# EAGLE design PCB_baseStation (EAGLE 6.5.0)
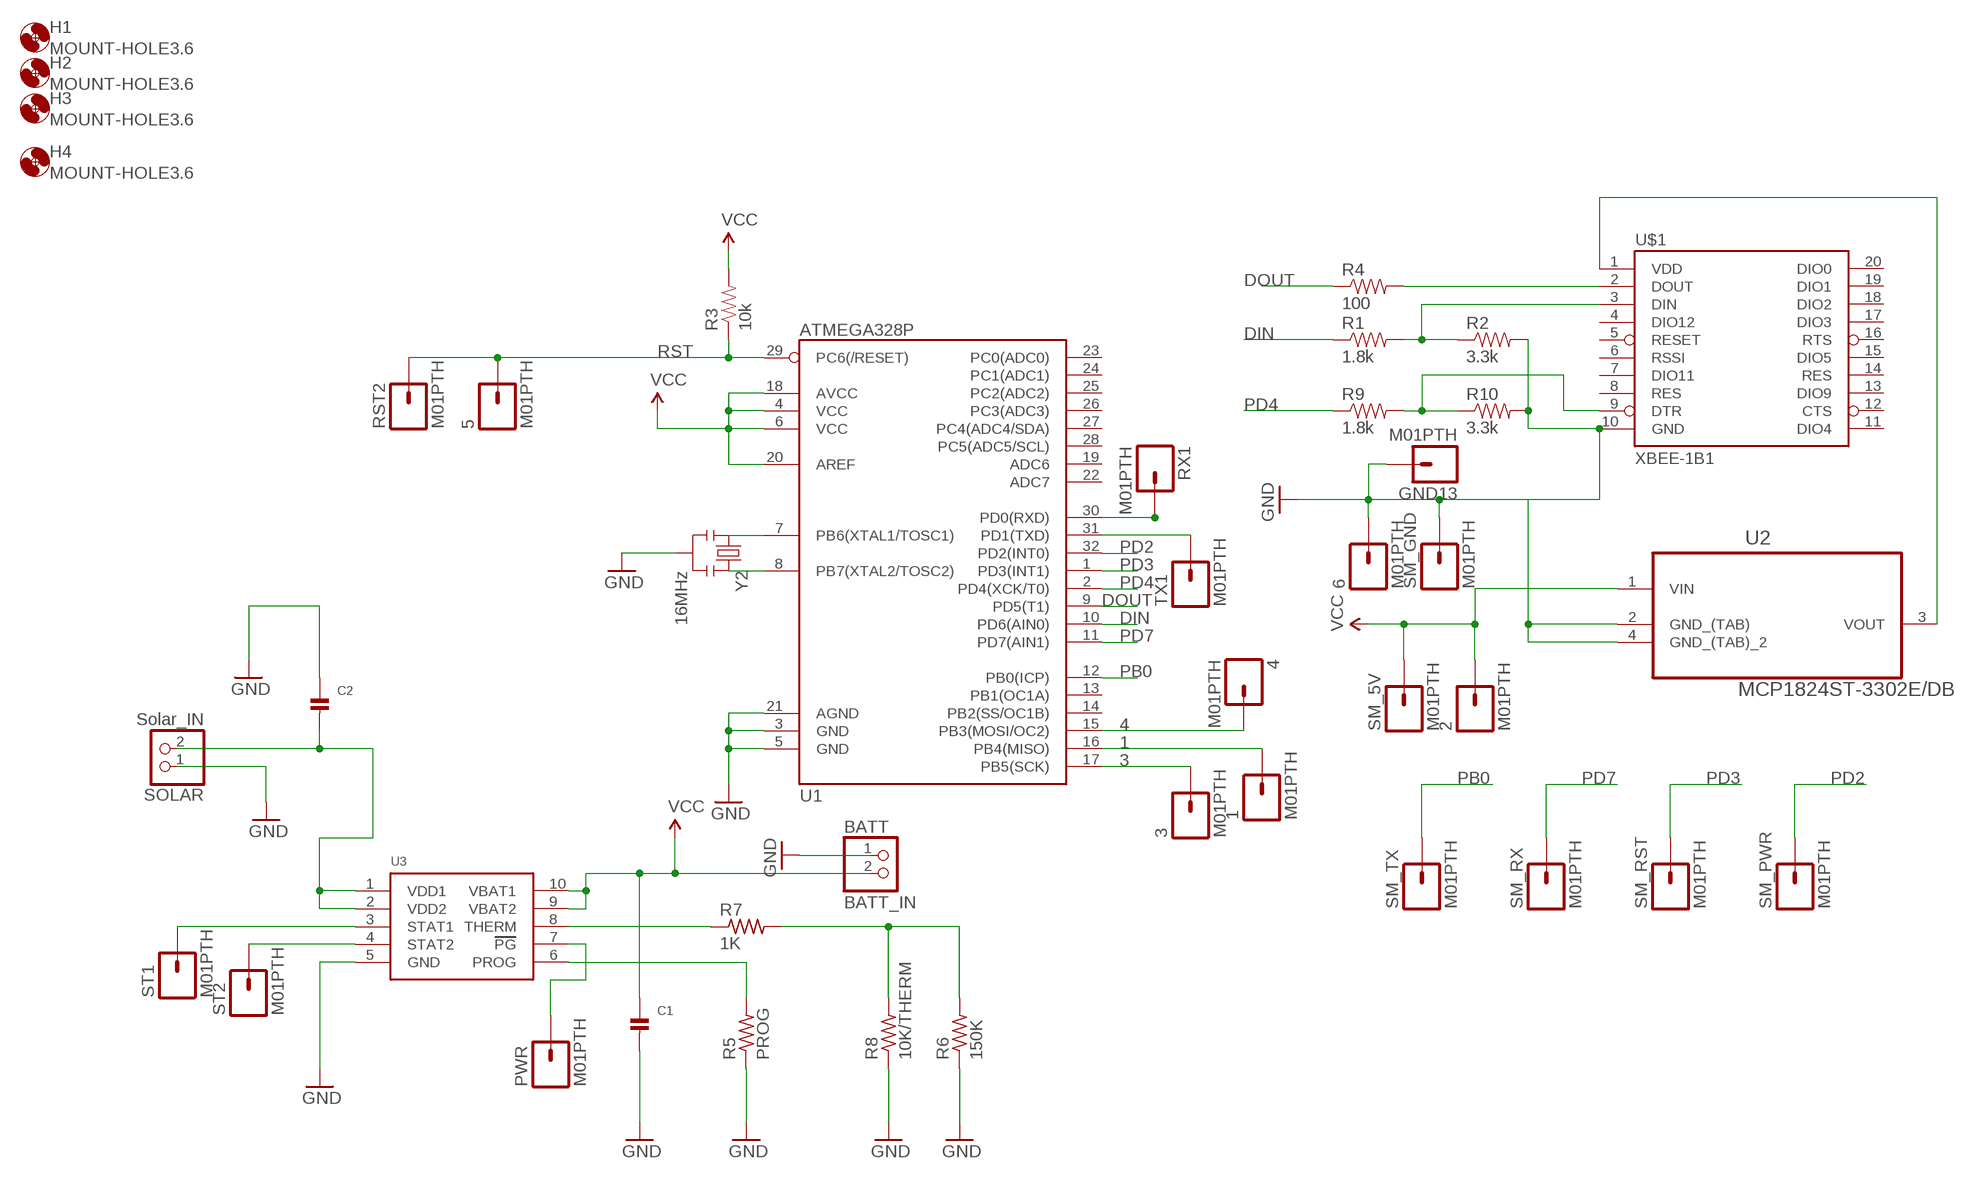
[diagram p0: schematic, sheet 1]

## Parts
1  M01PTH  [1X01]
2  M01PTH  [1X01]
3  M01PTH  [1X01]
4  M01PTH  [1X01]
5  M01PTH  [1X01]
6  M01PTH  [1X01]
BATT  BATT_IN  JST_2PIN  [JSTPH2]
C1  CAP_CERAMIC0805  [0805]
C2  CAP_CERAMIC0805  [0805]
GND13  M01PTH  [1X01]
H1  MOUNT-HOLE3.6  [3,6]
H2  MOUNT-HOLE3.6  [3,6]
H3  MOUNT-HOLE3.6  [3,6]
H4  MOUNT-HOLE3.6  [3,6]
PWR  M01PTH  [1X01]
R1  1.8k  1.8KOHM1/10W1%(0603)  [0603-RES]
R2  3.3k  3.3KOHM1/10W1%(0603)  [0603-RES]
R3  10k  RESISTOR1206  [1206]
R4  100  100OHM1/10W1%(0603)  [0603-RES]
R5  PROG  RESISTOR_DUAL  [0805-THM]
R6  150K  R-US_M0805  [M0805]
R7  1K  R-US_M0805  [M0805]
R8  10K/THERM  R-US_FLIPFLOP  [0805-THM]
R9  1.8k  1.8KOHM1/10W1%(0603)  [0603-RES]
R10  3.3k  3.3KOHM1/10W1%(0603)  [0603-RES]
RST2  M01PTH  [1X01]
RX1  M01PTH  [1X01]
SM_5V  M01PTH  [1X01]
SM_GND  M01PTH  [1X01]
SM_PWR  M01PTH  [1X01]
SM_RST  M01PTH  [1X01]
SM_RX  M01PTH  [1X01]
SM_TX  M01PTH  [1X01]
SOLAR  Solar_IN  JST_2PIN  [JSTPH2]
ST1  M01PTH  [1X01]
ST2  M01PTH  [1X01]
TX1  M01PTH  [1X01]
U1  ATMEGA328P  ATMEGA328_SMT  [TQFP32-08]
U2  MCP1824ST-3302E/DB  [SOT230P700X180-4N]
U3  MCP73833  [MSOP10]
U$1  XBEE-1B1  [XBEE-1]
Y2  16MHz  RESONATOR16MHZ  [RESONATOR-SMD]

## Nets
1: 1.1 U1.16(PB4(MISO))
3: 3.1 U1.17(PB5(SCK))
4: 4.1 U1.15(PB3(MOSI/OC2))
DIN: R1.1 U1.10(PD6(AIN0))
DOUT: R4.1 U1.9(PD5(T1))
GND: 6.1 BATT.1 C1.2 C2.1 GND13.1 R2.2 R5.1 R6.1 R8.1 R10.2 SM_GND.1 SOLAR.1 U1.3(GND) U1.5(GND) U1.21(AGND) U2.2(GND_(TAB)) U2.4(GND_(TAB)_2) U3.5(GND) U$1.10(GND) Y2.2
N$1: ST1.1 U3.3(STAT1)
N$2: ST2.1 U3.4(STAT2)
N$3: R1.2 R2.1 U$1.3(DIN)
N$4: R4.2 U$1.2(DOUT)
N$6: R9.2 R10.1 U$1.9(DTR)
N$7: U1.7(PB6(XTAL1/TOSC1)) Y2.1
N$8: U1.8(PB7(XTAL2/TOSC2)) Y2.3
N$9: C2.2 SOLAR.2 U3.1(VDD1) U3.2(VDD2)
N$10: R5.2 U3.6(PROG)
N$11: PWR.1 U3.7(PG)
N$13: R6.2 R7.2 R8.2
N$14: U2.3(VOUT) U$1.1(VDD)
N$15: R7.1 U3.8(THERM)
N$19: TX1.1 U1.31(PD1(TXD))
N$20: RX1.1 U1.30(PD0(RXD))
PB0: SM_TX.1 U1.12(PB0(ICP))
PD2: SM_PWR.1 U1.32(PD2(INT0))
PD3: SM_RST.1 U1.1(PD3(INT1))
PD4: R9.1 U1.2(PD4(XCK/T0))
PD7: SM_RX.1 U1.11(PD7(AIN1))
RST: 5.1 R3.1 RST2.1 U1.29(PC6(/RESET))
VCC: 2.1 BATT.2 C1.1 R3.2 SM_5V.1 U1.4(VCC) U1.6(VCC) U1.18(AVCC) U1.20(AREF) U2.1(VIN) U3.9(VBAT2) U3.10(VBAT1)
Unconnected: U1.13(PB1(OC1A)) U1.14(PB2(SS/OC1B)) U1.19(ADC6) U1.22(ADC7) U1.23(PC0(ADC0)) U1.24(PC1(ADC1)) U1.25(PC2(ADC2)) U1.26(PC3(ADC3)) U1.27(PC4(ADC4/SDA)) U1.28(PC5(ADC5/SCL)) U$1.4(DIO12) U$1.5(RESET) U$1.6(RSSI) U$1.7(DIO11) U$1.8(RES) U$1.11(DIO4) U$1.12(CTS) U$1.13(DIO9) U$1.14(RES) U$1.15(DIO5) U$1.16(RTS) U$1.17(DIO3) U$1.18(DIO2) U$1.19(DIO1) U$1.20(DIO0)

## Library data of the parts
1-6 GND13 PWR RST2 RX1 SM_5V SM_GND SM_PWR SM_RST SM_RX SM_TX ST1 ST2 TX1 = SparkFun-Connectors:M01: Header 1 Standard 1-pin 0.1" header. Use with straight break away headers (SKU : PRT-00116), right angle break away headers (PRT-00553), swiss pins (PRT-00743), machine pins (PRT-00117), and female headers (PRT-00115).
BATT SOLAR = microbuilder:JST_2PIN: JST 2-Pin Right-Angle Connector PH-Series - 4UConnector: 17311 SH-Series - 4UConnector: 07278
C1 C2 = microbuilder:CAP_CERAMIC: Ceramic Capacitors 0402 - 0402 Surface Mount Capacitors 16pF 50V 5% [Digikey: 445-4899-2-ND] 18pF 50V 5% [Digikey: 490-1281-2-ND] 22pF 50V 5% [Digikey: 490-1283-2-ND] 68pF 50V 5% [Digikey: 490-1289-2-ND] 0.1uF 10V 10% [Digikey: 490-1318-2-ND] 1.0uF 6.3V 10% [Digikey: 490-1320-2-ND] 0603 - 0603 Surface Mount Capacitors 16 pF 50V 5% [Digikey: 445-5051-2-ND] 22 pF 50V [Digikey: PCC220ACVTR-ND] 33 pF 50V 5% [Digikey: 490-1415-1-ND] 56pF 50V 5% [Digikey: 490-1421-1-ND] 220pF 50V 5% [Digikey: 445-1285-1-ND] 680 pF 50V 2200 pF 50V 5% C0G [Digikey: 445-1297-1-ND] 5600 pF 100V 5% X7R [Digikey: 478-3711-1-ND] 0.1 µF 25V 10% [Digikey: PCC2277TR-ND] 0.22 µF 16V 10% X7R [Digikey: 445-1318-1-ND] 1.0 µF 25V 10% [Digikey: 445-5146-2-ND] 0603 - RF Specific 3pF 250V +/-0.1pF RF [Digikey: 712-1347-1-ND] 18 pF 250V 5% [Digikey: 478-3505-1-ND or 712-1322-1-ND] 56 pF 250V 5% C0G RF [Digikey: 490-4867-1-ND] 68 pF 250V RF [Digikey: 490-4868-1-ND] 0805 - 0805 Surface Mount Capacitors 220 pF 250V 2% RF Ceramic Capacitor [Digikey: 712-1398-1-ND] 1000 pF 50V 2% NP0 Ceramic Capacitor [Digikey: 478-3760-1-ND] 0.1 µF 25V 10% Ceramic Capacitor [Digikey: PCC1828TR-ND] 1.0 µF 16V 10% Ceramic Capacitor[Digikey: 490-1691-2-ND] 10.0 µF 10V 10% Ceramic Capacitor[Digikey: 709-1228-1-ND] 10.0 uF 16V 10% Ceramic Capacitor [Digikey: 478-5165-2-ND] 47 uF 6.3V 20% Ceramic Capacitor [Digikey: 587-1779-1-ND or 399-5506-1-ND] 1206 - 1206 Surface Mount Capacitors 47uF 10V 20% Ceramic Capacitor [Digikey: 490-5528-1-ND or 399-5508-1-ND or 445-6010-1-ND] 100uF 6.3V -20%, +80% Y5V Ceramic Capacitor (Digikey: 490-4512-1-ND, Mouser: 81-GRM31CF50J107ZE1L)
H1-H4 = holes:MOUNT-HOLE: MOUNTING HOLE with drill center marker
R1 R9 = SparkFun-Resistors:1.8KOHM1/10W1%(0603): RES-09119; PROD_ID: RES-09119
R2 R10 = SparkFun-Resistors:3.3KOHM1/10W1%(0603): RES-07851; PROD_ID: RES-07851
R3 = SparkFun-Resistors:RESISTOR: Resistor Basic schematic elements and footprints for 0603, 1206, and PTH resistors.
R4 = SparkFun-Resistors:100OHM1/10W1%(0603): RES-07863; PROD_ID: RES-07863
R5 = microbuilder:RESISTOR_DUAL: Flip Flop resistor An 0805 resistor inside a standard 1/4W 5% resistor. Makes for easy mods Footprint taken from the Adafruit Industries Eagle Library.
R6-R8 = adafruit:R-US_: RESISTOR, American symbol
U1 = SparkFun-DigitalIC:ATMEGA328_SMT: 32-Pin Atmega328 part Commonly used on Arduino compatible boards Available in QFP and QFN packages TQFP is IC-09069 QFN is non-stock; PROD_ID: IC-09069
U2 = Microchip_By_element14_Batch_1:MCP1824ST-3302E/DB: IC, LDO VOLT REG, 3.3V, 0.3A,; MPN: MCP1824ST-3302E/DB; OC_FARNELL: 1578379; OC_NEWARK: 05N1293; PACKAGE: SOT-223-3; SUPPLIER: Microchip
U3 = microbuilder:MCP73833: Lithium-Polymer/Lithium-Ion Battery Charger [Part No.] Microchip MCP73833 MSOP10 (tube only): Digikey: MCP73833T-AMI/UN or MCP73833-FCI/UN-ND Mouser: 579-MCP73833-AMI/UN DFN10 (tape): Digikey: Note Chips ending in 'AMI' have no timer, and chips ending in 'FCI' have a 6-hour timer that will end the charge sequence after 6 horus regqrdless of current charge level.
U$1 = SparkFun-RF:XBEE-1: Xbee module footprints SMT header is CONN-09042.
Y2 = SparkFun-FreqCtrl:RESONATOR: Resonator Small SMD resonator. Used, eg, on the Arduino Pro/ Pro Mini boards. 8MHz- XTAL-08895 16MHz- XTAL-08900; PROD_ID: XTAL-08900

## Board
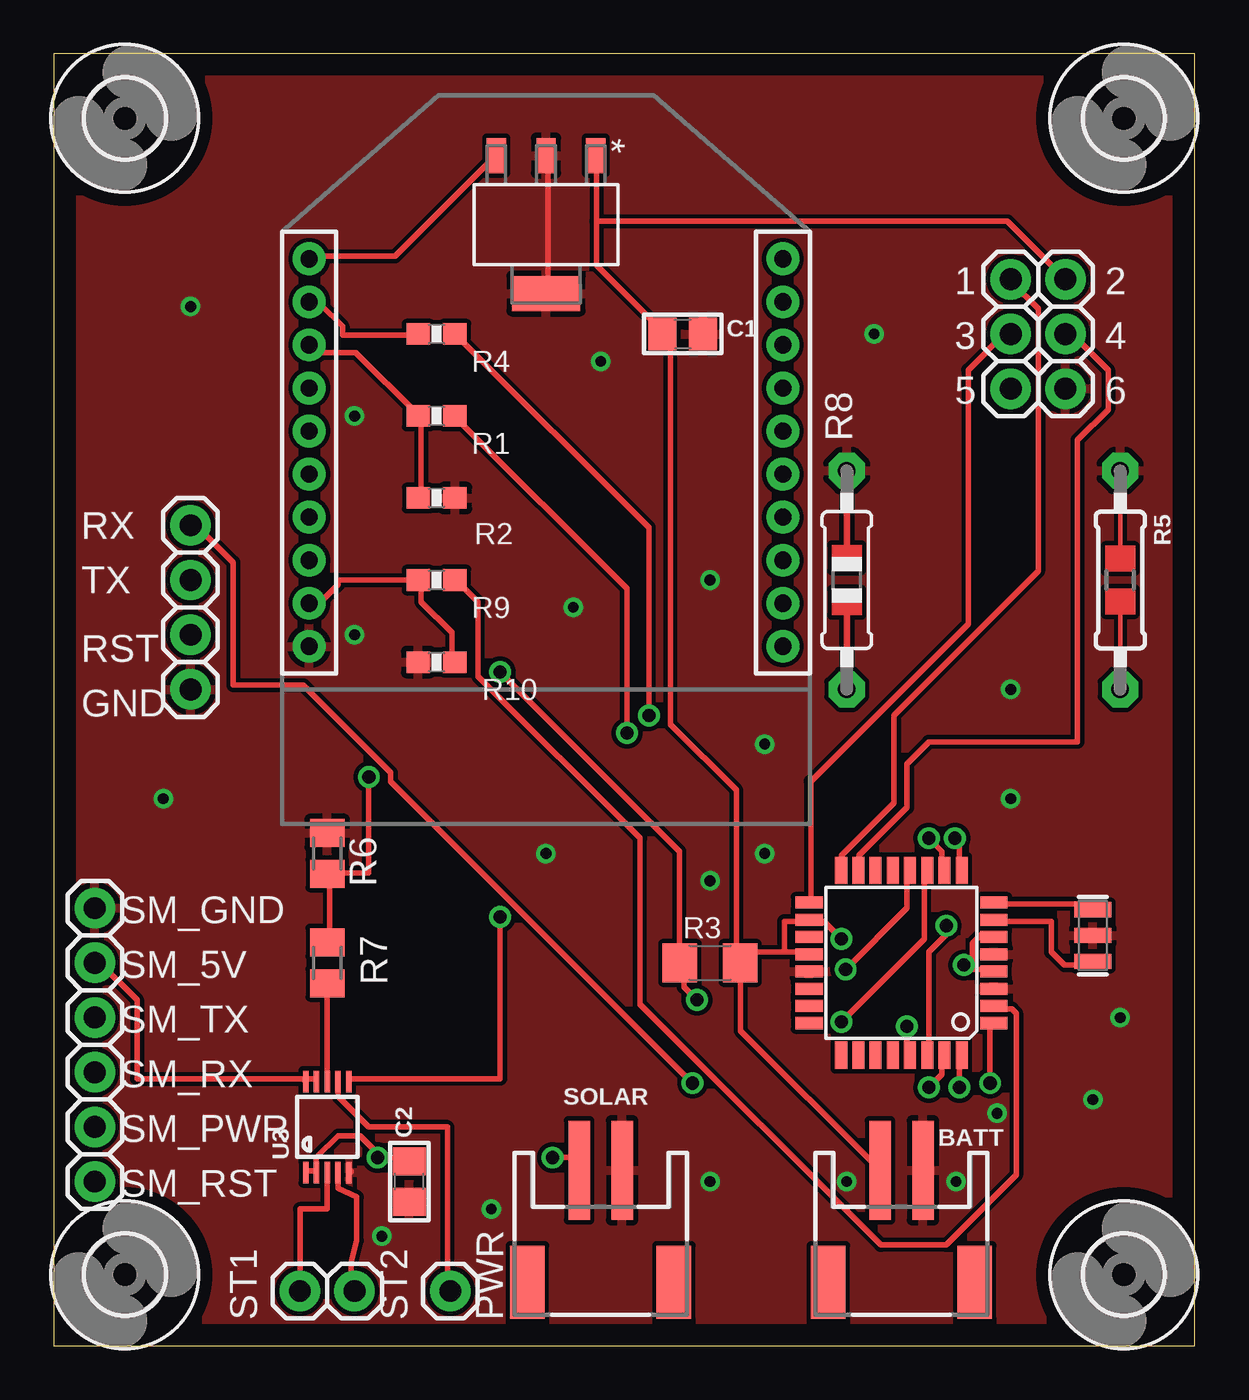
[diagram p1: board, top side]
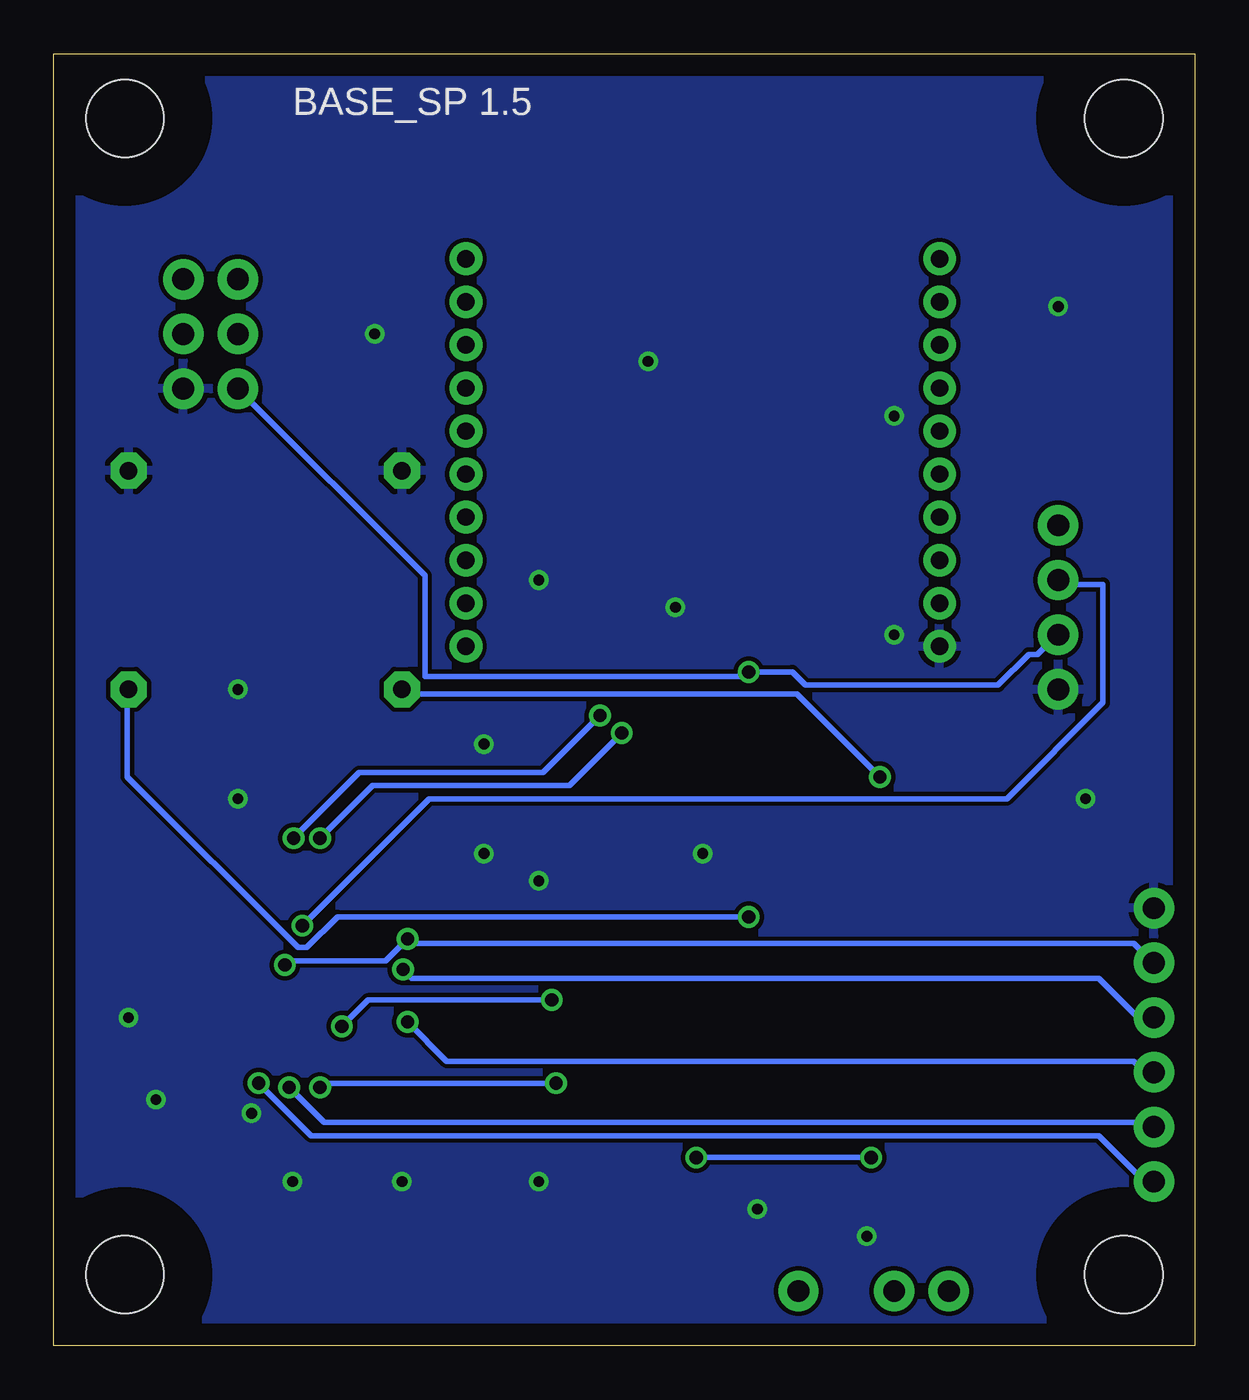
[diagram p2: board, bottom side, seen from below]

Size 53 x 60 mm. Coordinates in mm from the lower left corner, seen from the top.
Outline: 0,0 53,0 53,60 0,60 0,0
Copper layers (1*16): Top 0.035mm / dielectric 1.5mm / Bottom 0.035mm
Design rules "default": minimum track width 10mil, minimum drill 24mil, track to track 8mil, track to pad 8mil, pad to pad 8mil, via to via 8mil, smd to smd 8mil, copper to edge 40mil, drill to drill 8mil, minimum pad ring 10mil, minimum via ring 8mil, stop-mask expansion 4mil, vias tented up to drill 0mil, thermal gap 10mil

### Footprints (pad centres in the part's own frame; a part is rotated, then mirrored left to right if it is on the bottom)
1X01 = drill 1.016 pad 1.88: 1 0,0
JSTPH2 = smd 1 x 4.6: 1 -1,-3.7; 2 1,-3.7 | smd 1.6 x 3.4: NC1 -3.4,1.5; NC2 3.4,1.5
0805 = smd 1.3 x 1.5: 1 -0.95,0; 2 0.95,0
3,6 = hole 3.6: 0,0
0603-RES = smd 1.1 x 1: 1 -0.85,0; 2 0.85,0
1206 = smd 1.6 x 1.8: 1 -1.4,0; 2 1.4,0
0805-THM = drill 0.813 pad 1.676 octagon: 1 -5.08,0; 2 5.08,0
M0805 = smd 1.3 x 1.6: 1 -0.95,0; 2 0.95,0
TQFP32-08 = smd 1.27 x 0.559: 1 -4.293,2.8; 2 -4.293,2; 3 -4.293,1.2; 4 -4.293,0.4; 5 -4.293,-0.4; 6 -4.293,-1.2; 7 -4.293,-2; 8 -4.293,-2.8; 17 4.293,-2.8; 18 4.293,-2; 19 4.293,-1.2; 20 4.293,-0.4; 21 4.293,0.4; 22 4.293,1.2; 23 4.293,2; 24 4.293,2.8 | smd 0.559 x 1.27: 9 -2.8,-4.293; 10 -2,-4.293; 11 -1.2,-4.293; 12 -0.4,-4.293; 13 0.4,-4.293; 14 1.2,-4.293; 15 2,-4.293; 16 2.8,-4.293; 25 2.8,4.293; 26 2,4.293; 27 1.2,4.293; 28 0.4,4.293; 29 -0.4,4.293; 30 -1.2,4.293; 31 -2,4.293; 32 -2.8,4.293
SOT230P700X180-4N = smd 1.626 x 0.889: 1 -3.2,2.311; 2 -3.2,0; 3 -3.2,-2.311 | smd 1.626 x 3.175: 4 3.2,0
MSOP10 = smd 0.25 x 1: 1 -1,-2.113; 2 -0.5,-2.113; 3 0,-2.113; 4 0.5,-2.113; 5 1,-2.113; 6 1,2.113; 7 0.5,2.113; 8 0,2.113; 9 -0.5,2.113; 10 -1,2.113
XBEE-1 = drill 0.8 pad 1.524: 1 -11,20; 2 -11,18; 3 -11,16; 4 -11,14; 5 -11,12; 6 -11,10; 7 -11,8; 8 -11,6; 9 -11,4; 10 -11,2; 11 11,2; 12 11,4; 13 11,6; 14 11,8; 15 11,10; 16 11,12; 17 11,14; 18 11,16; 19 11,18; 20 11,20
RESONATOR-SMD = smd 0.7 x 1.7: 1 -1.2,0; 2 0,0; 3 1.2,0

### Placement (x,y rotation side)
1  44.45,49.53 0 top
2  46.99,49.53 0 top
3  44.45,46.99 0 top
4  46.99,46.99 0 top
5  44.45,44.45 0 top
6  46.99,44.45 0 top
BATT  39.37,4.45 180 top
C1  29.21,46.99 0 top
C2  16.51,7.62 90 top
GND13  6.35,30.48 0 top
H1  3.3,57 0 top
H2  3.3,3.3 0 top
H3  49.7,57 0 top
H4  49.7,3.3 0 top
PWR  18.41,2.54 0 top
R1  17.78,43.18 180 top
R2  17.78,39.37 0 top
R3  30.48,17.78 0 top
R4  17.78,46.99 180 top
R5  49.53,35.56 270 top
R6  12.7,22.86 270 top
R7  12.7,17.78 90 top
R8  36.83,35.56 270 top
R9  17.78,35.56 180 top
R10  17.78,31.75 180 top
RST2  6.35,33.02 0 top
RX1  6.35,35.56 0 top
SM_5V  1.91,17.78 0 top
SM_GND  1.91,20.32 0 top
SM_PWR  1.91,10.16 0 top
SM_RST  1.91,7.62 0 top
SM_RX  1.91,12.7 0 top
SM_TX  1.91,15.24 0 top
SOLAR  25.4,4.45 180 top
ST1  11.43,2.54 0 top
ST2  13.97,2.54 0 top
TX1  6.35,38.1 0 top
U1  39.37,17.78 180 top
U2  22.86,52.07 270 top
U3  12.7,10.16 0 top
U$1  22.86,30.48 0 top
Y2  48.26,19.05 90 top

### Tracks (layer width: path | path; a pad name or v marks a point on that pad's centre or on a via)
1
  Top 0.254: U1.16 36.58,22.15 36.58,22.76 39.01,25.2 39.01,29.26 45.72,35.97 45.72,48.16 44.5,49.38 1.1
3
  Top 0.254: U1.17 35.15,20.73 35.15,26.21 42.47,33.53 42.47,45.31 44.3,47.14 3.1
4
  Top 0.254: U1.15 37.39,22.15 37.39,22.76 39.62,24.99 39.62,27.03 40.64,28.04 47.55,28.04 47.55,42.06 48.97,43.48 48.97,45.31 47.14,47.14 4.1
DIN  (via drill 0.61)
  Top 0.254: v26.62,28.45 26.62,35.15 18.69,43.08 R1.1 | v40.64,23.57 41.25,22.96 41.25,22.15 U1.10
  Bottom 0.254: v26.62,28.45 29.06,26.01 38.2,26.01 v40.64,23.57
DOUT  (via drill 0.61)
  Top 0.254: v27.64,29.26 27.64,38 18.69,46.94 R4.1 | v41.86,23.57 42.06,23.37 42.06,22.15 U1.9
  Bottom 0.254: v27.64,29.26 30.28,26.62 38.81,26.62 v41.86,23.57
GND  (via drill 0.5)
  Top 0.254: U3.5 13.82,8.13 13.82,8.05 | 16.46,6.5 C2.1 | U2.2 22.96,55.27 22.96,48.97 U2.4
  other vias: 20.32,6.35 15.24,5.08 30.48,7.62 36.83,7.62 41.91,7.62 43.81,10.79 48.26,11.43 49.53,15.24 44.45,25.4 33.02,22.86 30.48,21.59 22.86,22.86 33.02,27.94 5.08,25.4 24.13,34.29 13.97,33.02 30.48,35.56 13.97,43.18 25.4,45.72 6.35,48.26 38.1,46.99 44.45,30.48
  pour Top: -3.81,62.23 -3.81,-2.54 55.88,-2.54 55.88,62.23
  pour Bottom: -3.81,58.42 -3.81,0 -3.81,-2.54 55.88,-2.54 55.88,-1.27 55.88,62.23 -3.81,62.23
N$1
  Top 0.254: U3.3 12.7,6.35 11.43,6.35 ST1.1
N$2
  Top 0.254: U3.4 13.21,7.92 13.21,7.32 14.07,6.91 14.07,4.88 13.82,3.86 13.82,2.64 ST2.1
N$3
  Top 0.254: R2.1 17.07,39.42 17.07,43.08 R1.2 16.87,43.28 14.02,46.13 11.99,46.13 11.99,46.33 U$1.3
N$4
  Top 0.254: R4.2 16.87,46.94 13.41,46.94 13.41,47.35 12.39,48.36 11.99,48.36 U$1.2
N$5
  Top 0.254: 6.3,35.56 6.35,35.56
N$6
  Top 0.254: R10.1 18.49,31.9 18.49,33.12 17.07,34.54 17.07,35.56 R9.2 13.21,35.56 13.21,35.36 12.39,34.54 11.99,34.54 U$1.9
N$7
  Top 0.254: U1.7 43.69,19.71 46.33,19.71 46.33,18.29 46.94,17.68 48.16,17.68 Y2.1
N$8
  Top 0.254: U1.8 43.69,20.52 48.16,20.52 48.16,20.32 Y2.3
N$9  (via drill 0.61)
  Top 0.254: 12.19,8.13 11.79,8.13 U3.1 | 12.19,8.13 12.19,8.74 13.21,9.75 14.22,9.75 15.04,8.94 | 15.04,8.94 15.24,8.74 16.46,8.74 C2.2 | 12.19,8.13 U3.2 | v15.04,8.74 15.04,8.94 | v23.16,8.74 24.38,8.74 24.38,8.33 SOLAR.2
  Bottom 0.254: v23.16,8.74 v15.04,8.74
N$10  (via drill 0.61)
  Top 0.254: v20.73,19.91 20.73,12.39 13.82,12.39 U3.6
  Bottom 0.254: v20.73,19.91 39.83,19.91 41.25,18.49 41.66,18.49 49.58,26.42 49.58,30.48 R5.2
N$11
  Top 0.254: U3.7 13.21,12.19 13.21,11.58 14.63,10.16 18.29,10.16 18.29,2.64 PWR.1
N$13  (via drill 0.61)
  Top 0.254: R7.2 12.8,18.9 12.8,21.74 R6.2 12.8,21.95 14.63,21.95 v14.63,26.42
  Bottom 0.254: v14.63,26.42 18.49,30.28 36.58,30.28 36.78,30.48 R8.2
N$14
  Top 0.254: U2.3 20.52,55.27 15.85,50.6 11.99,50.6 U$1.1
N$15
  Top 0.254: U3.8 R7.1
N$19  (via drill 0.61)
  Top 0.254: v40.64,11.99 41.25,12.6 41.25,13.41 U1.31 | v29.67,12.19 15.65,26.21 15.65,26.62 11.58,30.68 8.33,30.68 8.33,36.37 6.5,38.2 TX1.1
  Bottom 0.254: v40.64,11.99 40.44,12.19 v29.67,12.19
N$20  (via drill 0.61)
  Top 0.254: v41.45,19.51 41.45,19.1 40.64,18.29 40.64,13.61 U1.30
  Bottom 0.254: v41.45,19.51 35.56,25.4 8.74,25.4 4.27,29.87 4.27,35.36 6.1,35.36 6.3,35.56 RX1.1
PB0  (via drill 0.61)
  Top 0.254: v36.78,17.48 39.62,20.32 39.62,21.95 U1.12
  Bottom 0.254: v36.78,17.48 36.37,17.07 4.47,17.07 2.64,15.24 SM_TX.1
PD2  (via drill 0.61)
  Top 0.254: v42.06,11.99 42.06,13.41 U1.32
  Bottom 0.254: v42.06,11.99 40.44,10.36 2.23,10.36 2.03,10.16 SM_PWR.1
PD3  (via drill 0.61)
  Top 0.254: v43.48,12.19 43.48,14.83 U1.1
  Bottom 0.254: v43.48,12.19 41.05,9.75 4.47,9.75 2.44,7.72 2.03,7.72 SM_RST.1
PD4
  Top 0.254: R9.1 18.69,35.56 19.71,34.54 19.71,31.09 27.23,23.57 27.23,15.85 38.41,4.67 41.45,4.67 44.7,7.92 44.7,15.44 44.5,15.65 43.69,15.65 U1.2
PD7  (via drill 0.61)
  Top 0.254: v36.58,15.04 40.44,18.9 40.44,21.95 U1.11
  Bottom 0.254: v36.58,15.04 34.75,13.21 2.85,13.21 2.44,12.8 2.03,12.8 SM_RX.1
RST  (via drill 0.61)
  Top 0.254: v39.62,14.83 39.62,13.61 U1.29 | v29.87,16.05 29.26,16.66 29.26,17.68 R3.1 29.06,17.88 29.06,22.96 v20.73,31.29
  Bottom 0.254: v39.62,14.83 38.41,16.05 v29.87,16.05 | RST2.1 6.5,32.92 7.32,32.11 7.72,32.11 9.14,30.68 18.09,30.68 18.69,31.29 v20.73,31.29 20.93,31.09 35.76,31.09 35.76,35.76 5.1
VCC  (via drill 0.61)
  Top 0.254: 25.2,52.22 25.2,55.27 U2.1 | 25.2,52.22 25.2,50.19 28.25,47.14 C1.1 28.45,46.94 28.65,46.74 28.65,28.85 31.7,25.81 31.7,17.88 R3.2 | 2.1 44.3,52.22 25.2,52.22 | U3.9 12.19,12.39 11.79,12.39 U3.10 11.58,12.39 3.86,12.39 3.86,16.05 2.03,17.88 SM_5V.1 | 42.67,17.68 42.67,18.69 43.08,19.1 43.48,19.1 U1.6 | 42.67,17.68 42.67,17.48 43.48,17.48 U1.4 | 33.93,18.29 31.9,18.29 31.9,17.88 R3.2 | 33.93,18.29 34.95,18.29 U1.20 | 33.93,18.29 33.93,19.71 34.95,19.71 U1.18 35.15,19.71 35.76,19.71 v36.58,18.9 | v42.27,17.68 42.67,17.68 | BATT.2 38.2,8.33 31.9,14.63 31.9,17.68 R3.2
  Bottom 0.254: v42.27,17.68 42.06,17.88 37.59,17.88 36.78,18.69 | 36.78,18.69 2.85,18.69 2.03,17.88 SM_5V.1 | 36.78,18.69 v36.58,18.9

### Text on the board
tNames: RX | TX | RST | GND
bNames: BASE_SP 1.5